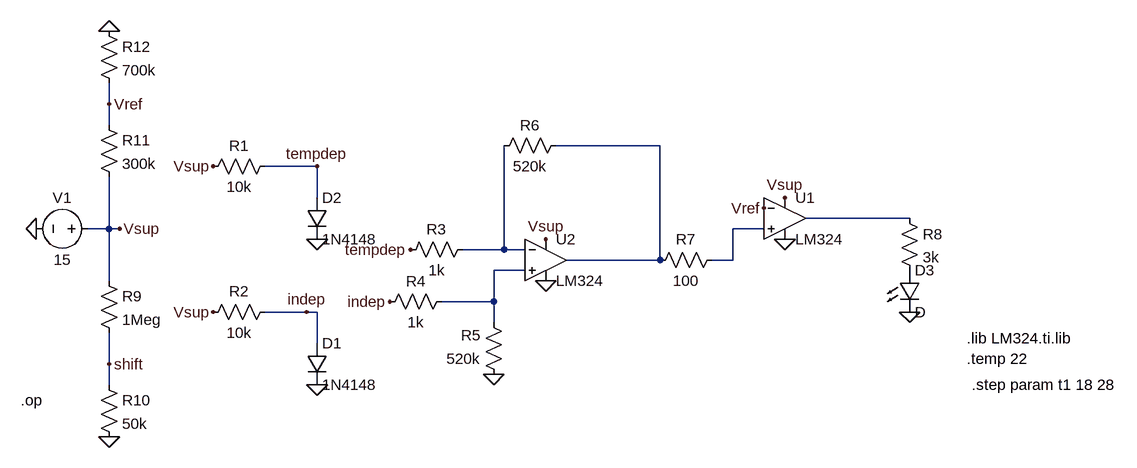
[diagram p0: schematic Lab1_alt_2.asc]
Lab1_alt_2.asc, the LTspice schematic file:
Version 4
SHEET 1 880 680
WIRE -720 -192 -720 -224
WIRE -720 -160 -720 -192
WIRE 128 -128 -32 -128
WIRE -400 -96 -480 -96
WIRE -400 -48 -400 -96
WIRE 512 -16 352 -16
WIRE -720 0 -720 -80
WIRE -720 0 -752 0
WIRE -704 0 -720 0
WIRE 288 0 240 0
WIRE -112 32 -112 -128
WIRE -112 32 -176 32
WIRE -80 32 -112 32
WIRE 128 48 128 -128
WIRE 128 48 -16 48
WIRE 240 48 240 0
WIRE 240 48 208 48
WIRE -80 64 -128 64
WIRE -720 80 -720 0
WIRE -128 112 -128 64
WIRE -128 112 -208 112
WIRE -416 128 -480 128
WIRE -400 128 -416 128
WIRE -128 144 -128 112
WIRE -400 176 -400 128
WIRE -720 208 -720 160
WIRE -720 240 -720 208
FLAG -832 0 0
FLAG -48 16 Vsup
FLAG -400 16 0
FLAG -400 240 0
FLAG -400 -96 tempdep
FLAG -560 -96 Vsup
FLAG -416 128 indep
FLAG -128 224 0
FLAG -256 32 tempdep
FLAG -288 112 indep
FLAG -704 0 Vsup
FLAG -560 128 Vsup
FLAG 320 -48 Vsup
FLAG 320 16 0
FLAG 512 128 0
FLAG 288 -32 Vref
FLAG -720 320 0
FLAG -720 -304 0
FLAG -720 -192 Vref
FLAG -720 208 shift
FLAG -48 80 0
SYMBOL voltage -736 0 R90
WINDOW 0 -32 56 VBottom 2
WINDOW 3 32 56 VTop 2
WINDOW 123 0 0 Left 0
WINDOW 39 0 0 Left 0
SYMATTR InstName V1
SYMATTR Value 15
SYMBOL OpAmps\\opamp2 -48 -16 R0
SYMATTR InstName U2
SYMATTR Value LM324
SYMBOL diode -416 176 R0
SYMATTR InstName D1
SYMATTR Value 1N4148
SYMBOL diode -416 -48 R0
SYMATTR InstName D2
SYMATTR Value 1N4148
SYMATTR Value2 temp={t1}
SYMBOL res -464 -112 R90
WINDOW 0 0 56 VBottom 2
WINDOW 3 32 56 VTop 2
SYMATTR InstName R1
SYMATTR Value 10k
SYMBOL res -464 112 R90
WINDOW 0 0 56 VBottom 2
WINDOW 3 32 56 VTop 2
SYMATTR InstName R2
SYMATTR Value 10k
SYMBOL res -160 16 R90
WINDOW 0 0 56 VBottom 2
WINDOW 3 32 56 VTop 2
SYMATTR InstName R3
SYMATTR Value 1k
SYMBOL res -192 96 R90
WINDOW 0 0 56 VBottom 2
WINDOW 3 32 56 VTop 2
SYMATTR InstName R4
SYMATTR Value 1k
SYMBOL res -112 240 R180
WINDOW 0 36 76 Left 2
WINDOW 3 36 40 Left 2
SYMATTR InstName R5
SYMATTR Value 520k
SYMBOL res -128 -112 R270
WINDOW 0 32 56 VTop 2
WINDOW 3 0 56 VBottom 2
SYMATTR InstName R6
SYMATTR Value 520k
SYMBOL OpAmps\\opamp2 320 -80 R0
SYMATTR InstName U1
SYMATTR Value LM324
SYMBOL res 224 32 R90
WINDOW 0 0 56 VBottom 2
WINDOW 3 32 56 VTop 2
SYMATTR InstName R7
SYMATTR Value 100
SYMBOL LED 496 64 R0
SYMATTR InstName D3
SYMBOL res 496 -32 R0
SYMATTR InstName R8
SYMATTR Value 3k
SYMBOL res -736 64 R0
SYMATTR InstName R9
SYMATTR Value 1Meg
SYMBOL res -736 224 R0
SYMATTR InstName R10
SYMATTR Value 50k
SYMBOL res -736 -176 R0
SYMATTR InstName R11
SYMATTR Value 300k
SYMBOL res -736 -320 R0
SYMATTR InstName R12
SYMATTR Value 700k
TEXT 600 168 Left 2 !.lib LM324.ti.lib
TEXT 600 200 Left 2 !.temp 22
TEXT 608 240 Left 2 !.step param t1 18 28
TEXT -856 264 Left 2 !.op

The netlist it stands for:
* Lab1_alt_2.asc
V1 Vsup 0 15
XU2 N005 N004 Vsup 0 N001 LM324  ; pins In+ In- V+ V- OUT
D1 indep 0 1N4148
D2 tempdep 0 1N4148 temp={t1}
R1 tempdep Vsup 10k
R2 indep Vsup 10k
R3 N004 tempdep 1k
R4 N005 indep 1k
R5 0 N005 520k
R6 N004 N001 520k
XU1 N003 Vref Vsup 0 N002 LM324  ; pins In+ In- V+ V- OUT
R7 N003 N001 100
D3 P001 0 D
R8 N002 P001 3k
R9 Vsup shift 1Meg
R10 shift 0 50k
R11 Vref Vsup 300k
R12 0 Vref 700k
.model D D
.lib standard.dio
.lib LM324.ti.lib
.temp 22
.step param t1 18 28
.op
.backanno
.end